# Altium schematic sheet Power_Regulators_Digital_5.SchDoc
size A4; DocumentNumber: 34; SheetNumber: 34; SheetTotal: 47
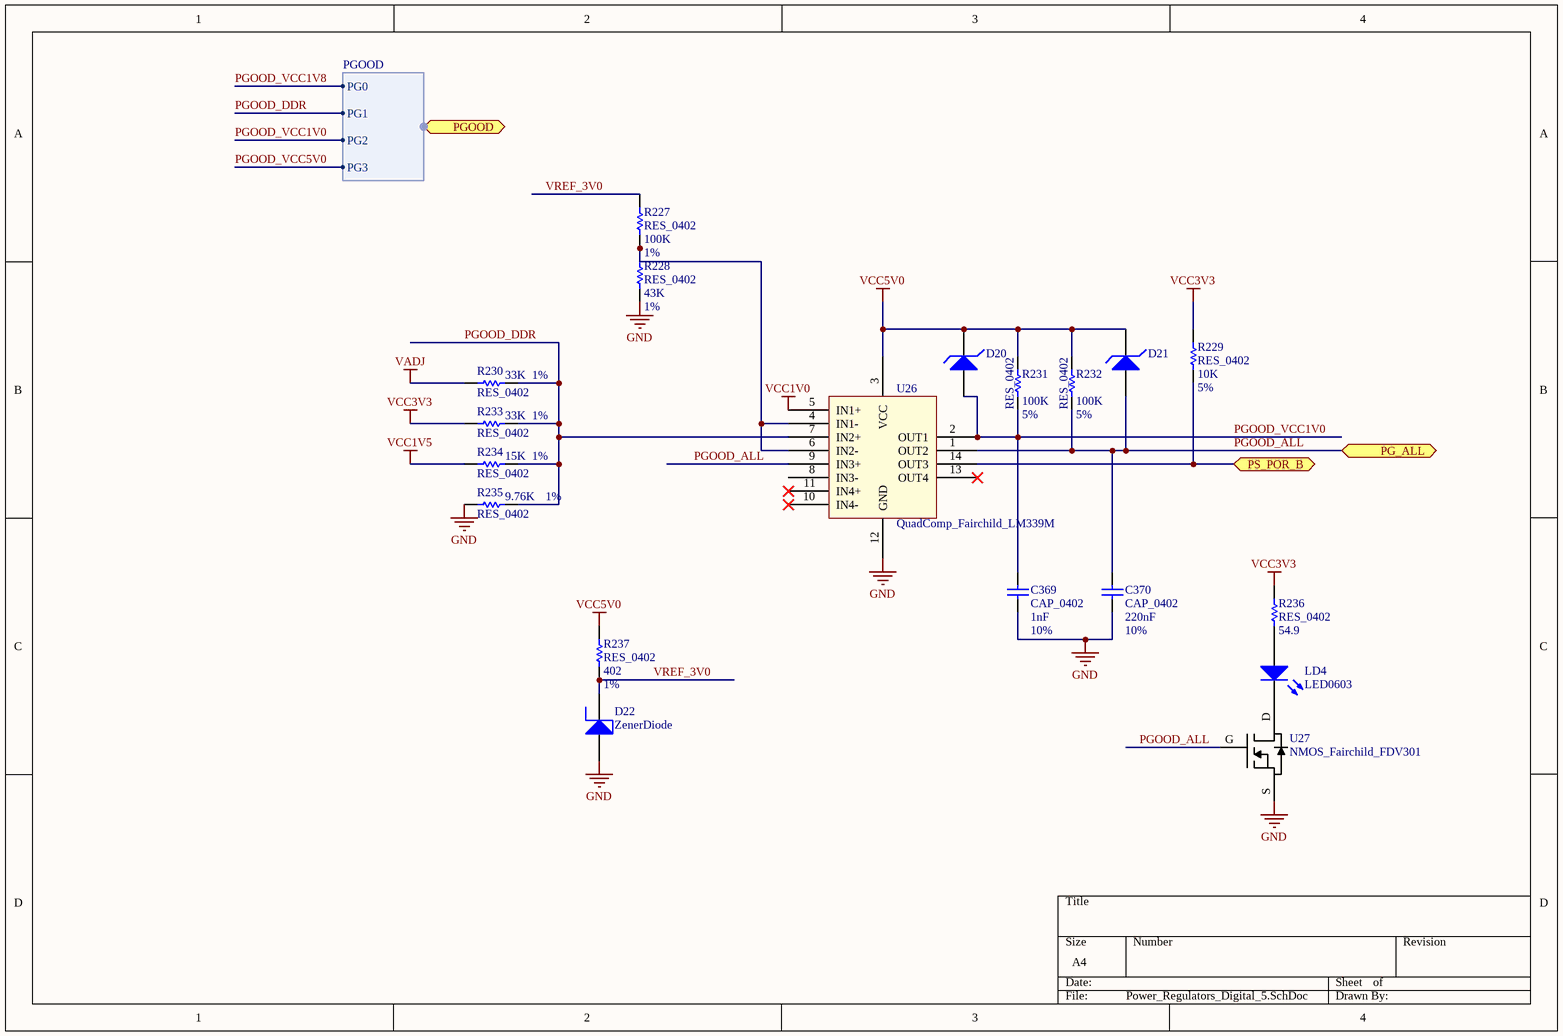
[diagram p0: Power_Regulators_Digital_5.SchDoc]

## Parts
C369  CAP_0402  value 1nF  Tolerance: 10%  [CAPC0402(1005)60_N]
C370  CAP_0402  value 220nF  Tolerance: 10%  [CAPC0402(1005)60_N]
D20  Shottky Diode  [SchottkyDiode_RB751S40_2-PIN]  (value not drawn)
D21  Shottky Diode  [SchottkyDiode_RB751S40_2-PIN]  (value not drawn)
D22  ZenerDiode  [ZenerDiode_BZX84-A3V0215_SOT23-3]
LD4  LED0603  [LED0603(1608)_HSMG-C190]
R227  RES_0402  value 100K  Tolerance: 1%  [RESC0402(1005)_N]
R228  RES_0402  value 43K  Tolerance: 1%  [RESC0402(1005)_N]
R229  RES_0402  value 10K  Tolerance: 5%  [RESC0402(1005)_N]
R230  RES_0402  value 33K  Tolerance: 1%  [RESC0402(1005)_N]
R231  RES_0402  value 100K  Tolerance: 5%  [RESC0402(1005)_N]
R232  RES_0402  value 100K  Tolerance: 5%  [RESC0402(1005)_N]
R233  RES_0402  value 33K  Tolerance: 1%  [RESC0402(1005)_N]
R234  RES_0402  value 15K  Tolerance: 1%  [RESC0402(1005)_N]
R235  RES_0402  value 9.76K  Tolerance: 1%  [RESC0402(1005)_N]
R236  RES_0402  value 54.9  [RESC0402(1005)_N]
R237  RES_0402  value 402  Tolerance: 1%  [RESC0402(1005)_N]
U26  QuadComp_Fairchild_LM339M  [QuadComp_Fairchild_LM339MX-NOPB_14SOIC]
U27  NMOS_Fairchild_FDV301  [NMOS_Fairchild_FDV301_SOT23-3]

## Ports
PG_ALL (bidir), PGOOD (harness PGOOD), PS_POR_B (bidir)

## Harnesses
PGOOD: PG0, PG1, PG2, PG3

## Nets
GND: C369.1 C370.1 D22.1(A) R228.1 R235.1 U26.12(GND) U27.S
VADJ: R230.1
VCC1V0: U26.5(IN1+)
VCC1V5: R234.1
VCC3V3: R229.2 R233.1 R236.2
VCC5V0: D20.1(K) D21.1(K) R231.2 R232.2 R237.2 U26.3(VCC)
PGOOD_ALL: C370.2 D21.2(A) R232.1 U26.1(OUT2) U26.9(IN3+) U27.G ; port PG_ALL
PGOOD_DDR: R230.2 R233.2 R234.2 R235.2 U26.7(IN2+) ; port PGOOD.PG1
PGOOD_VCC1V0: C369.2 D20.2(A) R231.1 U26.2(OUT1) ; port PGOOD.PG2
PGOOD_VCC1V8: port PGOOD.PG0
PGOOD_VCC5V0: port PGOOD.PG3
PS_POR_B: R229.1 U26.14(OUT3) ; port PS_POR_B
VREF_3V0: D22.3(K) R227.2 R237.1
NetLD4_1: LD4.1(K) U27.D
NetLD4_2: LD4.2(A) R236.1
NetR227_1: R227.1 R228.2 U26.4(IN1-) U26.6(IN2-)

Not connected (* = marked no-connect by the designer): U26 8(IN3-) 10(IN4-)* 11(IN4+)* 13(OUT4)*

## Library data of the parts
C369 = ECJ-0EB1E102K: 1000pF, ceramic, 10% 25V X7R, 0402; Manufacturer: Panasonic - ECG; Part Number: ECJ-0EB1E102K; Footprint Ref: CAPC0402(1005)60_N; Library Ref: CAP_0402
C370 = LMK105BJ224KV-F: 0.22uF, ceramic, 10% 10V X5R, 0402; Manufacturer: Taiyo Yuden; Part Number: LMK105BJ224KV-F; Footprint Ref: CAPC0402(1005)60_N; Library Ref: CAP_0402
D20 D21 = RB751S40: RB751S40, 40V 30mA schottky, SOD523F; Manufacturer: FAIRCHILD SEMICONDUCTOR; Part Number: RB751S40; Footprint Ref: SchottkyDiode_RB751S40_2-PIN; Library Ref: ShottkyDiode
D22 = BZX84-A3V0,215: BZX84-A3V0, VReg 250mW 3V, SOT23; Manufacturer: NXP Semiconductors; Part Number: BZX84-A3V0,215; Footprint Ref: ZenerDiode_BZX84-A3V0215_SOT23-3; Library Ref: ZenerDiode_BZX84-A3V0
LD4 = "HSMG-C190": LED 570NM GREEN DIFF 0603 SMD; Manufacturer: Avago; Value: "HSMG-C190 green"; Part Number: "HSMG-C190"; Footprint Ref: LED0603(1608); Library Ref: LED0603
R227 = MCR01MZPF1003: 100K ohm, 1%, 1/16W, 0402; Manufacturer: ROHM; Part Number: MCR01MZPF1003; Footprint Ref: RESC0402(1005)_N; Library Ref: RES_0402
R228 = ERJ-2RKF4302X: 43K ohm, 1% 1/10W, 0402; Manufacturer: Panasonic - ECG; Part Number: ERJ-2RKF4302X; Footprint Ref: RESC0402(1005)_N; Library Ref: RES_0402
R229 = RC0402JR-0710KL: 10K ohm, 5%, 1/16W, 0402; Manufacturer: Yageo America; Part Number: RC0402JR-0710KL; Footprint Ref: RESC0402(1005)_N; Library Ref: RES_0402
R230 R233 = RK73H1ETTP3302F: 33K ohms, 1% 1/16W, 0402; Manufacturer: KOA Speer Electronics; Part Number: RK73H1ETTP3302F; Footprint Ref: RESC0402(1005)_N; Library Ref: RES_0402
R231 R232 = RC0402JR-07100KL: 100K ohm, 5%, 1/16W, 0402; Manufacturer: Yageo America; Part Number: RC0402JR-07100KL; Footprint Ref: RESC0402(1005)_N; Library Ref: RES_0402
R234 = ERJ-2RKF1502X: 15K ohm, 1% 1/10W, 0402; Manufacturer: Panasonic - ECG; Part Number: ERJ-2RKF1502X; Footprint Ref: RESC0402(1005)_N; Library Ref: RES_0402
R235 = CRCW04029K76FKED: 9.76K ohm, 1% 1/16W, 0402; Manufacturer: Vishay/Dale; Part Number: CRCW04029K76FKED; Footprint Ref: RESC0402(1005)_N; Library Ref: RES_0402
R236 = ERJ-2RKF54R9X: RES 54.9 OHM 1/10W 1% 0402 SMD; Manufacturer: Panasonic Electronic Components; Tolerance: *; Part Number: ERJ-2RKF54R9X; Footprint Ref: RESC0402(1005)_N; Library Ref: RES_0402
R237 = CRCW0402402RFKED: 402 ohm, 1%, 1/16W, 0402; Manufacturer: Vishay/Dale; Part Number: CRCW0402402RFKED; Footprint Ref: RESC0402(1005)_N; Library Ref: RES_0402
U26 = LM339MX/NOPB: Quad Comparator,14-SOP; Part Number: LM339MX/NOPB; Manufacturer: Fairchild
U27 = FDV301N: MOSFET N-CH 25V 220MA SOT-23; Manufacturer: Fairchild Semiconductor; Part Number: FDV301N; Footprint Ref: NMOS_Fairchild_FDV301_SOT23-3; Library Ref: NMOS_Fairchild_FDV301